# Altium schematic sheet SoC_2.SchDoc
size A3; SheetNumber: 6; SheetTotal: 10
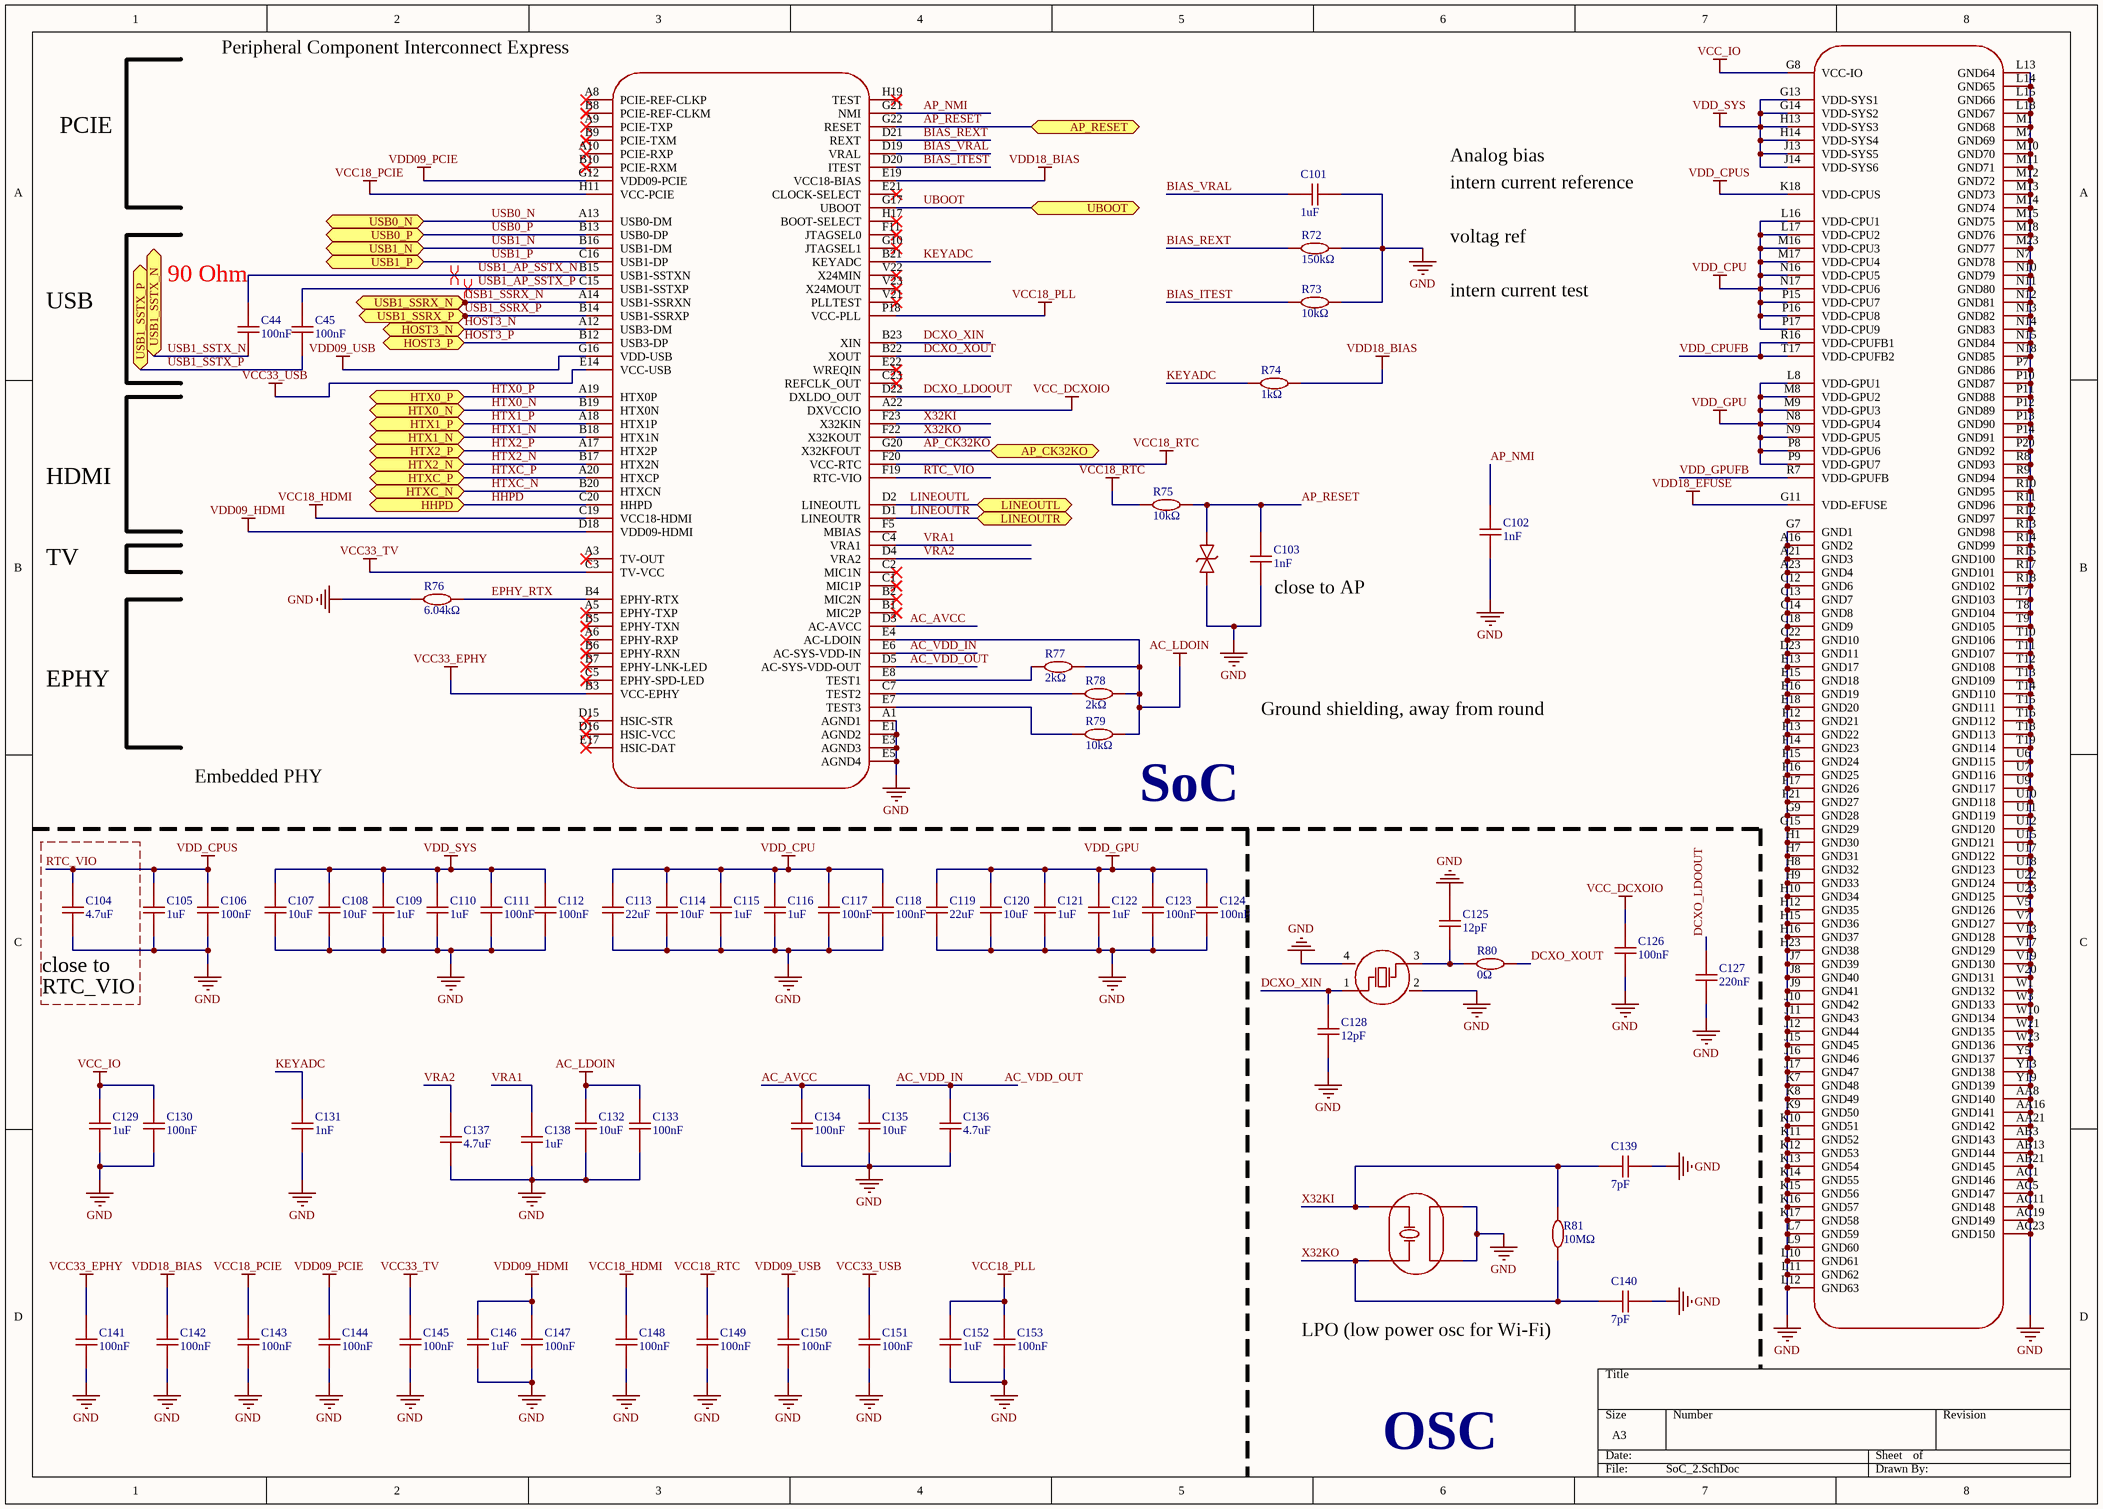
[diagram p0: SoC_2.SchDoc]

## Parts
C44  100nF  [C0402]
C45  100nF  [C0402]
C101  1uF  [C0402]
C102  1nF  [C0402]
C103  1nF  [C0402]
C104  4.7uF  [C0402]
C105  1uF  [C0402]
C106  100nF  [C0402]
C107  10uF  [C0603]
C108  10uF  [C0603]
C109  1uF  [C0402]
C110  1uF  [C0402]
C111  100nF  [C0402]
C112  100nF  [C0402]
C113  22uF  [C0603]
C114  10uF  [C0603]
C115  1uF  [C0402]
C116  1uF  [C0402]
C117  100nF  [C0402]
C118  100nF  [C0402]
C119  22uF  [C0603]
C120  10uF  [C0603]
C121  1uF  [C0402]
C122  1uF  [C0402]
C123  100nF  [C0402]
C124  100nF  [C0402]
C125  12pF  [C0402]
C126  100nF  [C0402]
C127  220nF  [C0402]
C128  12pF  [C0402]
C129  1uF  [C0402]
C130  100nF  [C0402]
C131  1nF  [C0402]
C132  10uF  [C0603]
C133  100nF  [C0402]
C134  100nF  [C0402]
C135  10uF  [C0603]
C136  4.7uF  [C0402]
C137  4.7uF  [C0402]
C138  1uF  [C0402]
C139  7pF  [C0402]
C140  7pF  [C0402]
C141  100nF  [C0402]
C142  100nF  [C0402]
C143  100nF  [C0402]
C144  100nF  [C0402]
C145  100nF  [C0402]
C146  1uF  [C0402]
C147  100nF  [C0402]
C148  100nF  [C0402]
C149  100nF  [C0402]
C150  100nF  [C0402]
C151  100nF  [C0402]
C152  1uF  [C0402]
C153  100nF  [C0402]
R72  150kΩ  [R0402]
R73  10kΩ  [R0402]
R74  1kΩ  [R0402]
R75  10kΩ  [R0402]
R76  6.04kΩ  [R0402]
R77  2kΩ  [R0402]
R78  2kΩ  [R0402]
R79  10kΩ  [R0402]
R80  0Ω  [R0402]
R81  10MΩ  [R0402]
U2  Allwinner_H6  [BGA451_ALLWINNER_H6]  (value not drawn)  (parts C,D of 4)
U32  ESD5451N  [DFN1006-2L-BI]  (value not drawn)
X2  24MHz  [CRYSTAL-SMD_4P-L3.2-W2.5-BL]  (value not drawn)
X3  32.768kHz  [MC-146_4P-L6.7-W1.5-P0.85-TL]  (value not drawn)

## Ports
AP_CK32KO (bidir, see Wi-Fi[5B]), AP_RESET (bidir, see GPIO[6C], Power[4B]), HHPD (bidir, see Audio-HDMI[4C]), HOST3_N (bidir, see TF-USB[3C]), HOST3_P (bidir, see TF-USB[3C]), HTX0_N (bidir, see Audio-HDMI[4C]), HTX0_P (bidir, see Audio-HDMI[4C]), HTX1_N (bidir, see Audio-HDMI[4C]), HTX1_P (bidir, see Audio-HDMI[4B]), HTX2_N (bidir, see Audio-HDMI[4B]), HTX2_P (bidir, see Audio-HDMI[4B]), HTXC_N (bidir, see Audio-HDMI[4C]), HTXC_P (bidir, see Audio-HDMI[4C]), LINEOUTL (bidir, see Audio-HDMI[6A]), LINEOUTR (bidir, see Audio-HDMI[6A]), UBOOT (bidir, see GPIO[6C]), USB0_N (bidir, see TF-USB[8A]), USB0_P (bidir, see TF-USB[8A]), USB1_N (bidir, see TF-USB[5C]), USB1_P (bidir, see TF-USB[5C]), USB1_SSRX_N (bidir, see SoC_2[2A], TF-USB[6C]), USB1_SSRX_P (bidir, see TF-USB[6C]), USB1_SSTX_N (bidir, see TF-USB[6C]), USB1_SSTX_P (bidir, see TF-USB[6C])

## Nets
AC_LDOIN: C132.2 C133.2 R77.2 R78.2 R79.1 U2.E4(AC-LDOIN)
GND: C101.2 C102.1 C103.1 C104.1 C105.1 C106.1 C107.1 C108.1 C109.1 C110.1 C111.1 C112.1 C113.1 C114.1 C115.1 C116.1 C117.1 C118.1 C119.1 C120.1 C121.1 C122.1 C123.1 C124.1 C125.2 C126.1 C127.1 C128.1 C129.1 C130.1 C131.1 C132.1 C133.1 C134.1 C135.1 C136.1 C137.1 C138.1 C139.2 C140.2 C141.1 C142.1 C143.1 C144.1 C145.1 C146.1 C147.1 C148.1 C149.1 C150.1 C151.1 C152.1 C153.1 R72.2 R73.2 R76.1 U2.A1(AGND1) U2.A16(GND2) U2.A21(GND3) U2.A23(GND4) U2.AA8(GND140) U2.AA16(GND141) U2.AA21(GND142) U2.AB3(GND143) U2.AB13(GND144) U2.AB21(GND145) U2.AC1(GND146) U2.AC5(GND147) U2.AC11(GND148) U2.AC19(GND149) U2.AC23(GND150) U2.C12(GND6) U2.C13(GND7) U2.C14(GND8) U2.C18(GND9) U2.C22(GND10) U2.D23(GND11) U2.E1(AGND2) U2.E3(AGND3) U2.E5(AGND4) U2.E13(GND17) U2.E15(GND18) U2.E16(GND19) U2.E18(GND20) U2.F12(GND21) U2.F13(GND22) U2.F14(GND23) U2.F15(GND24) U2.F16(GND25) U2.F17(GND26) U2.F21(GND27) U2.G7(GND1) U2.G9(GND28) U2.G15(GND29) U2.H1(GND30) U2.H7(GND31) U2.H8(GND32) U2.H9(GND33) U2.H10(GND34) U2.H12(GND35) U2.H15(GND36) U2.H16(GND37) U2.H23(GND38) U2.J7(GND39) U2.J8(GND40) U2.J9(GND41) U2.J10(GND42) U2.J11(GND43) U2.J12(GND44) U2.J15(GND45) U2.J16(GND46) U2.J17(GND47) U2.K7(GND48) U2.K8(GND49) U2.K9(GND50) U2.K10(GND51) U2.K11(GND52) U2.K12(GND53) U2.K13(GND54) U2.K14(GND55) U2.K15(GND56) U2.K16(GND57) U2.K17(GND58) U2.L7(GND59) U2.L9(GND60) U2.L10(GND61) U2.L11(GND62) U2.L12(GND63) U2.L13(GND64) U2.L14(GND65) U2.L15(GND66) U2.L18(GND67) U2.M1(GND68) U2.M7(GND69) U2.M10(GND70) U2.M11(GND71) U2.M12(GND72) U2.M13(GND73) U2.M14(GND74) U2.M15(GND75) U2.M18(GND76) U2.M23(GND77) U2.N7(GND78) U2.N10(GND79) U2.N11(GND80) U2.N12(GND81) U2.N13(GND82) U2.N14(GND83) U2.N15(GND84) U2.N18(GND85) U2.P7(GND86) U2.P10(GND87) U2.P11(GND88) U2.P12(GND89) U2.P13(GND90) U2.P14(GND91) U2.P20(GND92) U2.R8(GND93) U2.R9(GND94) U2.R10(GND95) U2.R11(GND96) U2.R12(GND97) U2.R13(GND98) U2.R14(GND99) U2.R15(GND100) U2.R17(GND101) U2.R18(GND102) U2.T7(GND103) U2.T8(GND104) U2.T9(GND105) U2.T10(GND106) U2.T11(GND107) U2.T12(GND108) U2.T13(GND109) U2.T14(GND110) U2.T15(GND111) U2.T16(GND112) U2.T18(GND113) U2.T19(GND114) U2.U6(GND115) U2.U7(GND116) U2.U9(GND117) U2.U10(GND118) U2.U11(GND119) U2.U12(GND120) U2.U15(GND121) U2.U17(GND122) U2.U18(GND123) U2.U22(GND124) U2.U23(GND125) U2.V5(GND126) U2.V7(GND127) U2.V13(GND128) U2.V17(GND129) U2.V19(GND130) U2.V20(GND131) U2.W1(GND132) U2.W3(GND133) U2.W10(GND134) U2.W21(GND135) U2.W23(GND136) U2.Y5(GND137) U2.Y13(GND138) U2.Y19(GND139) U32.1 X2.2(GND) X2.4(GND) X3.2 X3.3
RTC_VIO: C104.2 C105.2 C106.2 U2.F19(RTC-VIO) U2.K18(VDD-CPUS)  [also labelled VDD_CPUS]
VCC18_HDMI: C148.2 U2.C19(VCC18-HDMI)
VCC18_PCIE: C143.2 U2.H11(VCC-PCIE)
VCC18_PLL: C152.2 C153.2 U2.P18(VCC-PLL)
VCC18_RTC: C149.2 R75.1 U2.F20(VCC-RTC)
VCC33_EPHY: C141.2 U2.B3(VCC-EPHY)
VCC33_TV: C145.2 U2.C3(TV-VCC)
VCC33_USB: C151.2 U2.E14(VCC-USB)
VCC_DCXOIO: C126.2 U2.A22(DXVCCIO)
VCC_IO: C129.2 C130.2 U2.G8(VCC-IO)
VDD09_HDMI: C146.2 C147.2 U2.D18(VDD09-HDMI)
VDD09_PCIE: C144.2 U2.G12(VDD09-PCIE)
VDD09_USB: C150.2 U2.G16(VDD-USB)
VDD18_BIAS: C142.2 R74.2 U2.E19(VCC18-BIAS)
VDD18_EFUSE: U2.G11(VDD-EFUSE)
VDD_CPU: C113.2 C114.2 C115.2 C116.2 C117.2 C118.2 U2.L16(VDD-CPU1) U2.L17(VDD-CPU2) U2.M16(VDD-CPU3) U2.M17(VDD-CPU4) U2.N16(VDD-CPU5) U2.N17(VDD-CPU6) U2.P15(VDD-CPU7) U2.P16(VDD-CPU8) U2.P17(VDD-CPU9)
VDD_GPU: C119.2 C120.2 C121.2 C122.2 C123.2 C124.2 U2.L8(VDD-GPU1) U2.M8(VDD-GPU2) U2.M9(VDD-GPU3) U2.N8(VDD-GPU4) U2.N9(VDD-GPU5) U2.P8(VDD-GPU6) U2.P9(VDD-GPU7)
VDD_SYS: C107.2 C108.2 C109.2 C110.2 C111.2 C112.2 U2.G13(VDD-SYS1) U2.G14(VDD-SYS2) U2.H13(VDD-SYS3) U2.H14(VDD-SYS4) U2.J13(VDD-SYS5) U2.J14(VDD-SYS6)
AC_AVCC: C134.2 C135.2 U2.D3(AC-AVCC)
AC_VDD_IN: C136.2 U2.D5(AC-SYS-VDD-OUT) U2.E6(AC-SYS-VDD-IN)  [also labelled AC_VDD_OUT]
AP_CK32KO: U2.G20(X32KFOUT) ; port AP_CK32KO
AP_NMI: C102.2 U2.G21(NMI)
AP_RESET: C103.2 R75.2 U2.G22(RESET) U32.2 ; port AP_RESET
BIAS_ITEST: R73.1 U2.D20(ITEST)
BIAS_REXT: R72.1 U2.D21(REXT)
BIAS_VRAL: C101.1 U2.D19(VRAL)
DCXO_LDOOUT: C127.2 U2.D22(DXLDO_OUT)
DCXO_XIN: C128.2 U2.B23(XIN) X2.1(OSC1)
DCXO_XOUT: R80.2 U2.B22(XOUT)
EPHY_RTX: R76.2 U2.B4(EPHY-RTX)
HHPD: U2.C20(HHPD) ; port HHPD
HOST3_N: U2.A12(USB3-DM) ; port HOST3_N
HOST3_P: U2.B12(USB3-DP) ; port HOST3_P
HTX0_N: U2.B19(HTX0N) ; port HTX0_N
HTX0_P: U2.A19(HTX0P) ; port HTX0_P
HTX1_N: U2.B18(HTX1N) ; port HTX1_N
HTX1_P: U2.A18(HTX1P) ; port HTX1_P
HTX2_N: U2.B17(HTX2N) ; port HTX2_N
HTX2_P: U2.A17(HTX2P) ; port HTX2_P
HTXC_N: U2.B20(HTXCN) ; port HTXC_N
HTXC_P: U2.A20(HTXCP) ; port HTXC_P
KEYADC: C131.2 R74.1 U2.B21(KEYADC)
LINEOUTL: U2.D2(LINEOUTL) ; port LINEOUTL
LINEOUTR: U2.D1(LINEOUTR) ; port LINEOUTR
UBOOT: U2.G17(UBOOT) ; port UBOOT
USB0_N: U2.A13(USB0-DM) ; port USB0_N
USB0_P: U2.B13(USB0-DP) ; port USB0_P
USB1_AP_SSTX_N: C44.2 U2.B15(USB1-SSTXN)
USB1_AP_SSTX_P: C45.2 U2.C15(USB1-SSTXP)
USB1_N: U2.B16(USB1-DM) ; port USB1_N
USB1_P: U2.C16(USB1-DP) ; port USB1_P
USB1_SSRX_N: U2.A14(USB1-SSRXN) ; port USB1_SSRX_N
USB1_SSRX_P: U2.B14(USB1-SSRXP) ; port USB1_SSRX_P
USB1_SSTX_N: C44.1 ; port USB1_SSTX_N
USB1_SSTX_P: C45.1 ; port USB1_SSTX_P
VDD_CPUFB: U2.R16(VDD-CPUFB1) U2.T17(VDD-CPUFB2)
VDD_GPUFB: U2.R7(VDD-GPUFB)
VRA1: C138.2 U2.C4(VRA1)
VRA2: C137.2 U2.D4(VRA2)
X32KI: C139.1 R81.2 U2.F23(X32KIN) X3.4(OSC2)
X32KO: C140.1 R81.1 U2.F22(X32KOUT) X3.1(OSC1)
NetC125_1: C125.1 R80.1 X2.3(OSC2)
NetR77_1: R77.1 U2.E8(TEST1)
NetR78_1: R78.1 U2.C7(TEST2)
NetR79_2: R79.2 U2.E7(TEST3)

Not connected (* = marked no-connect by the designer): U2 A3(TV-OUT)* A5(EPHY-TXP)* A6(EPHY-RXP)* A8(PCIE-REF-CLKP)* A9(PCIE-TXP)* A10(PCIE-RXP)* B1(MIC2P)* B2(MIC2N)* B5(EPHY-TXN)* B6(EPHY-RXN)* B7(EPHY-LNK-LED)* B8(PCIE-REF-CLKM)* B9(PCIE-TXM)* B10(PCIE-RXM)* C1(MIC1P)* C2(MIC1N)* C5(EPHY-SPD-LED)* C23(REFCLK_OUT)* D15(HSIC-STR)* D16(HSIC-VCC)* E17(HSIC-DAT)* E21(CLOCK-SELECT)* E22(WREQIN)* F5(MBIAS) F11(JTAGSEL0)* G10(JTAGSEL1)* H17(BOOT-SELECT)* H19(TEST)* V21(PLLTEST)* V22(X24MIN)* V23(X24MOUT)*

## Layout directives
differential pair: USB1_AP_SSTX_N, USB1_AP_SSTX_P

## Notes on the sheet
- (near U2) Peripheral Component Interconnect Express
- PCIE
- Analog bias
- intern current reference
- voltag ref
- USB
- (near C44) 90 Ohm
- intern current test
- HDMI
- TV
- (near C103) close to AP
- EPHY
- Ground shielding, away from round
- Embedded PHY
- (near R79) SoC
- close to
- RTC_VIO
- (near C140) LPO (low power osc for Wi-Fi)
- OSC

## Library data of the parts
C44 C45 C106 C111 C112 C117 C118 C123 C124 C126 C130 C133 C134 C141-C145 C147-C151 C153 = 100nF: 50V 100nF X7R ±10% 0402 Ceramic Capacitors ROHS
C101 C105 C109 C110 C115 C116 C121 C122 C129 C138 C146 C152 = 1uF: 50V 1uF X5R ±10% 0402 Ceramic Capacitors ROHS
C102 C103 C131 = 1nF: 50V 1nF X7R ±10% 0402 Ceramic Capacitors ROHS
C104 C136 C137 = 4.7uF: 10V 4.7uF X5R ±20% 0402 Ceramic Capacitors ROHS
C107 C108 C114 C120 C132 C135 = 10uF: 10V 10uF X5R ±10% 0603 Ceramic Capacitors ROHS
C113 C119 = 22uF: 16V 22uF X5R ±20% 0603 Ceramic Capacitors ROHS
C125 C128 = 12pF: 50V 12pF C0G ±5% 0402 Ceramic Capacitors ROHS
C127 = 220nF: 16V 220nF X7R ±10% 0402 Ceramic Capacitors ROHS
C139 C140 = 7pF: 50V 7pF NP0 0402 Ceramic Capacitors ROHS
R72 = 150kΩ: 62.5mW 150kΩ 50V ±100ppm/℃ Thick Film Resistor ±1% 0402 Chip Resistor - Surface Mount ROHS
R73 R75 R79 = 10kΩ: 62.5mW 10kΩ 50V ±100ppm/℃ Thick Film Resistor ±1% 0402 Chip Resistor - Surface Mount ROHS
R74 = 1kΩ: 1kΩ 62.5mW 50V ±100ppm/℃ Thick Film Resistor ±1% 0402 Chip Resistor - Surface Mount ROHS
R76 = 6.04kΩ: 6.04kΩ 62.5mW 50V ±100ppm/℃ Thick Film Resistor ±1% 0402 Chip Resistor - Surface Mount ROHS
R77 R78 = 2kΩ: 100mW 2kΩ 75V ±100ppm/℃ Thick Film Resistor ±1% 0402 Chip Resistor - Surface Mount ROHS
R80 = 0Ω: 0Ω 62.5mW 50V Thick Film Resistor ±1% 0402 Chip Resistor - Surface Mount ROHS
R81 = 10MΩ: 62.5mW 10MΩ 50V ±100ppm/℃ Thick Film Resistor ±1% 0402 Chip Resistor - Surface Mount ROHS
U2 = Allwinner_H6: Add into BOM: yes; Symbol: Allwinner_H6; Device: Allwinner_H6; Convert to PCB: yes
U32 = ESD5451N_C5261080: 9A 9.8V 8V Bidirectional 5V DFN1006-2L TVS Diodes ROHS; Manufacturer: HXY MOSFET(华轩阳电子); Add into BOM: yes; Reverse Leakage Current (Ir): 500nA; Number of Channels: 1.0; level of protection: IEC 61000-4-2; Junction Capacitance: 15pF; Symbol: ESD5451N_C5261080; Device: ESD5451N_C5261080; LCSC Part Name: 5V 15pF 双向; Supplier Part: C5261080; Manufacturer Part: ESD5451N; Supplier Footprint: DFN1006-2L; JLCPCB Part Class: Extended Part; Datasheet: https://item.szlcsc.com/datasheet/ESD5451N/5983779.html; Supplier: LCSC; Convert to PCB: yes; Polarity: Bidirectional; Reverse Stand-Off Voltage (Vrwm): 5V; Clamping Voltage: 9.8V; Peak Pulse Current (Ipp): 9A; Voltage - Breakdown: 8V; Type: ESD
X2 = X322524MOB4SI: Crystal Oscillator 12pF SMD3225-4P Crystals ROHS; Manufacturer: YXC(扬兴晶振); Add into BOM: yes; Normal temperature Frequency Tolerance: ±10ppm; Frequency Stability: ±20ppm; Symbol: X322524MOB4SI; Device: X322524MOB4SI; LCSC Part Name: YSX321SL 24MHZ 4P 3225 12PF ±10PPM -40~85℃ (±20PPM); Supplier Part: C70590; Manufacturer Part: X322524MOB4SI; Supplier Footprint: SMD3225-4P; JLCPCB Part Class: Extended Part; Datasheet: https://item.szlcsc.com/datasheet/X322524MOB4SI/71688.html; Supplier: LCSC; Convert to PCB: yes; Type: Surface Mount Crystal; Value: 24MHz; Load Capacitance: 12pF; Operating Temperature: -40℃~+85℃
X3 = Q13MC14610001: Crystal Oscillator 7pF MC-146 Crystals ROHS; Manufacturer: EPSON(爱普生); Symbol: MC-14632.768kHz7.0pF20PPM; Add into BOM: yes; Normal temperature Frequency Tolerance: ±20ppm; Equivalent Series Resistance(ESR): 65kΩ; Device: Q13MC14610001; LCSC Part Name: 32.768kHz ±20ppm 7pF; Supplier Part: C94977; Manufacturer Part: Q13MC14610001; Supplier Footprint: MC-146; JLCPCB Part Class: Extended Part; Datasheet: https://atta.szlcsc.com/upload/public/pdf/source/20170211/1486785670215.pdf; Supplier: LCSC; Convert to PCB: yes; Type: Surface Mount Crystal; Value: 32.768kHz; Operating Temperature: -40℃~+85℃